# Altium schematic sheet 模拟部分.SchDoc
size A4
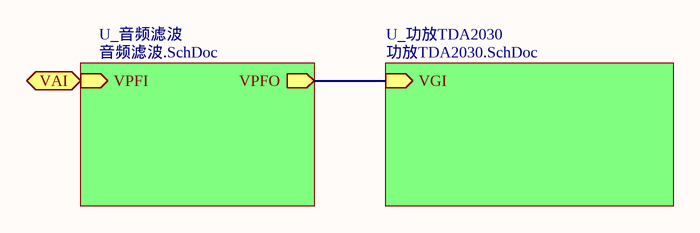
[diagram p0: 模拟部分.SchDoc]

## Sub-sheets
U_功放TDA2030 = 功放TDA2030.SchDoc: VGI (in)
U_音频滤波 = 音频滤波.SchDoc: VPFI (in), VPFO (out)

## Ports
VAI (in)

## Nets
VAI: port VAI, sheet U_音频滤波/VPFI
(unnamed): sheet U_音频滤波/VPFO, sheet U_功放TDA2030/VGI

## Notes on the sheet
- 标题
- 日期
- 红外数字模拟接收一体机
- 2015 5 29
- 作者
- 模电组
- 单位
- 电子技术协会